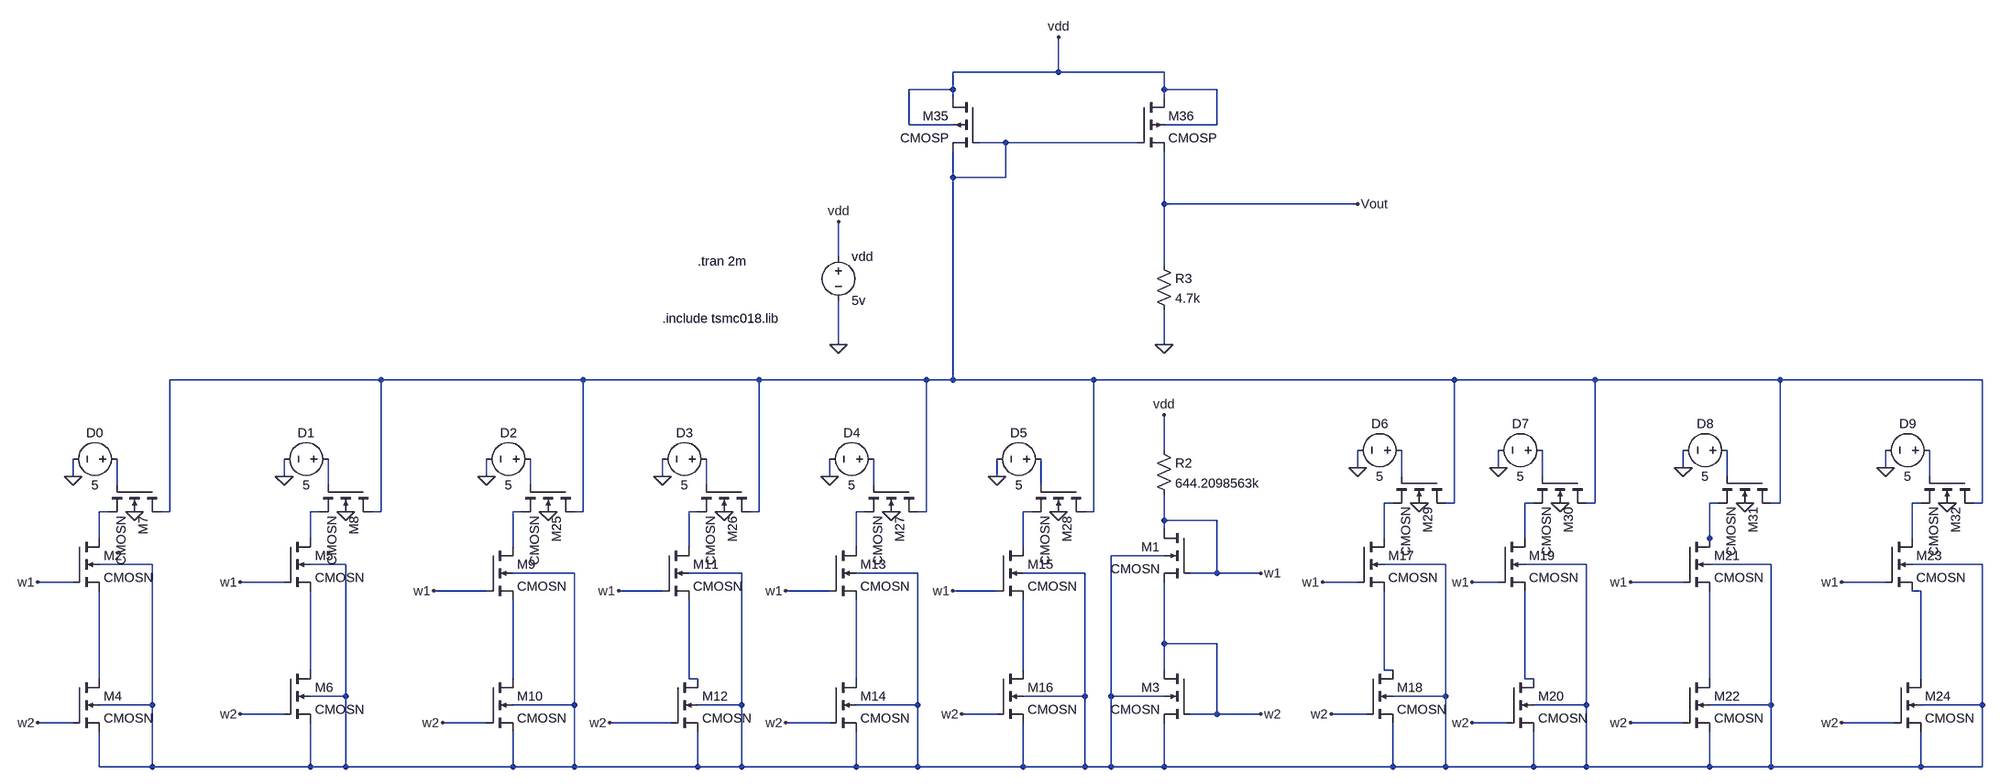
[diagram p0: schematic cd.asc]
cd.asc, the LTspice schematic file:
Version 4
SHEET 1 7472 1236
WIRE 2464 -832 2464 -896
WIRE 2464 -832 2272 -832
WIRE 2656 -832 2464 -832
WIRE 2272 -800 2272 -832
WIRE 2272 -800 2192 -800
WIRE 2656 -800 2656 -832
WIRE 2752 -800 2656 -800
WIRE 2272 -784 2272 -800
WIRE 2656 -784 2656 -800
WIRE 2192 -736 2192 -800
WIRE 2272 -736 2192 -736
WIRE 2752 -736 2752 -800
WIRE 2752 -736 2656 -736
WIRE 2368 -704 2320 -704
WIRE 2608 -704 2368 -704
WIRE 2272 -640 2272 -688
WIRE 2368 -640 2368 -704
WIRE 2368 -640 2272 -640
WIRE 2656 -592 2656 -688
WIRE 3008 -592 2656 -592
WIRE 2064 -496 2064 -560
WIRE 2656 -480 2656 -592
WIRE 2064 -336 2064 -416
WIRE 2656 -336 2656 -400
WIRE 1232 -272 848 -272
WIRE 1600 -272 1232 -272
WIRE 1920 -272 1600 -272
WIRE 2224 -272 1920 -272
WIRE 2272 -272 2272 -640
WIRE 2272 -272 2224 -272
WIRE 2528 -272 2272 -272
WIRE 3184 -272 2528 -272
WIRE 3440 -272 3184 -272
WIRE 3776 -272 3440 -272
WIRE 4144 -272 3776 -272
WIRE 2656 -144 2656 -208
WIRE 3008 -112 3008 -144
WIRE 3264 -112 3264 -144
WIRE 3600 -112 3600 -144
WIRE 3968 -112 3968 -144
WIRE 672 -96 672 -128
WIRE 1056 -96 1056 -128
WIRE 1424 -96 1424 -128
WIRE 1744 -96 1744 -128
WIRE 2048 -96 2048 -128
WIRE 2352 -96 2352 -128
WIRE 3088 -96 3088 -144
WIRE 3344 -96 3344 -144
WIRE 3680 -96 3680 -144
WIRE 4048 -96 4048 -144
WIRE 752 -80 752 -128
WIRE 1136 -80 1136 -128
WIRE 1504 -80 1504 -128
WIRE 1824 -80 1824 -128
WIRE 2128 -80 2128 -128
WIRE 2432 -80 2432 -128
WIRE 3072 -48 3056 -48
WIRE 3184 -48 3184 -272
WIRE 3184 -48 3168 -48
WIRE 3328 -48 3312 -48
WIRE 3440 -48 3440 -272
WIRE 3440 -48 3424 -48
WIRE 3664 -48 3648 -48
WIRE 3776 -48 3776 -272
WIRE 3776 -48 3760 -48
WIRE 4032 -48 4016 -48
WIRE 4144 -48 4144 -272
WIRE 4144 -48 4128 -48
WIRE 736 -32 720 -32
WIRE 848 -32 848 -272
WIRE 848 -32 832 -32
WIRE 1120 -32 1104 -32
WIRE 1232 -32 1232 -272
WIRE 1232 -32 1216 -32
WIRE 1488 -32 1472 -32
WIRE 1600 -32 1600 -272
WIRE 1600 -32 1584 -32
WIRE 1808 -32 1792 -32
WIRE 1920 -32 1920 -272
WIRE 1920 -32 1904 -32
WIRE 2112 -32 2096 -32
WIRE 2224 -32 2224 -272
WIRE 2224 -32 2208 -32
WIRE 2416 -32 2400 -32
WIRE 2528 -32 2528 -272
WIRE 2528 -32 2512 -32
WIRE 2656 -16 2656 -64
WIRE 2752 -16 2656 -16
WIRE 2656 0 2656 -16
WIRE 720 16 720 -32
WIRE 1104 16 1104 -32
WIRE 3056 16 3056 -48
WIRE 3312 16 3312 -48
WIRE 3648 16 3648 -48
WIRE 4016 16 4016 -48
WIRE 1472 32 1472 -32
WIRE 1792 32 1792 -32
WIRE 2096 32 2096 -32
WIRE 2400 32 2400 -32
WIRE 3648 32 3648 16
WIRE 2656 48 2560 48
WIRE 816 64 720 64
WIRE 1168 64 1104 64
WIRE 3168 64 3056 64
WIRE 3424 64 3312 64
WIRE 3760 64 3648 64
WIRE 4144 64 4016 64
WIRE 1584 80 1472 80
WIRE 1888 80 1792 80
WIRE 2208 80 2096 80
WIRE 2512 80 2400 80
WIRE 2752 80 2752 -16
WIRE 2752 80 2704 80
WIRE 2832 80 2752 80
WIRE 672 96 608 96
WIRE 1056 96 976 96
WIRE 3008 96 2944 96
WIRE 3264 96 3216 96
WIRE 3600 96 3504 96
WIRE 3968 96 3888 96
WIRE 1424 112 1328 112
WIRE 1744 112 1664 112
WIRE 2048 112 1968 112
WIRE 2352 112 2272 112
WIRE 4032 112 4016 112
WIRE 2656 208 2656 96
WIRE 2752 208 2656 208
WIRE 1104 256 1104 112
WIRE 2400 256 2400 128
WIRE 2656 256 2656 208
WIRE 3056 256 3056 112
WIRE 3072 256 3056 256
WIRE 720 272 720 112
WIRE 1472 272 1472 128
WIRE 1792 272 1792 128
WIRE 1808 272 1792 272
WIRE 2096 272 2096 128
WIRE 3312 272 3312 112
WIRE 3328 272 3312 272
WIRE 3648 272 3648 112
WIRE 4032 272 4032 112
WIRE 1168 304 1168 64
WIRE 1168 304 1104 304
WIRE 2512 304 2512 80
WIRE 2512 304 2400 304
WIRE 2560 304 2560 48
WIRE 2656 304 2560 304
WIRE 3168 304 3168 64
WIRE 3168 304 3072 304
WIRE 816 320 816 64
WIRE 816 320 720 320
WIRE 1584 320 1584 80
WIRE 1584 320 1472 320
WIRE 1888 320 1888 80
WIRE 1888 320 1808 320
WIRE 2208 320 2208 80
WIRE 2208 320 2096 320
WIRE 3424 320 3424 64
WIRE 3424 320 3328 320
WIRE 3760 320 3760 64
WIRE 3760 320 3648 320
WIRE 4144 320 4144 64
WIRE 4144 320 4032 320
WIRE 1056 336 976 336
WIRE 2352 336 2288 336
WIRE 2752 336 2752 208
WIRE 2752 336 2704 336
WIRE 2832 336 2752 336
WIRE 3024 336 2960 336
WIRE 672 352 608 352
WIRE 1424 352 1344 352
WIRE 1760 352 1648 352
WIRE 2048 352 1968 352
WIRE 3280 352 3216 352
WIRE 3600 352 3504 352
WIRE 3984 352 3888 352
WIRE 720 432 720 368
WIRE 816 432 816 320
WIRE 816 432 720 432
WIRE 1104 432 1104 352
WIRE 1104 432 816 432
WIRE 1168 432 1168 304
WIRE 1168 432 1104 432
WIRE 1472 432 1472 368
WIRE 1472 432 1168 432
WIRE 1584 432 1584 320
WIRE 1584 432 1472 432
WIRE 1808 432 1808 368
WIRE 1808 432 1584 432
WIRE 1888 432 1888 320
WIRE 1888 432 1808 432
WIRE 2096 432 2096 368
WIRE 2096 432 1888 432
WIRE 2208 432 2208 320
WIRE 2208 432 2096 432
WIRE 2400 432 2400 352
WIRE 2400 432 2208 432
WIRE 2512 432 2512 304
WIRE 2512 432 2400 432
WIRE 2560 432 2560 304
WIRE 2560 432 2512 432
WIRE 2656 432 2656 352
WIRE 2656 432 2560 432
WIRE 3072 432 3072 352
WIRE 3072 432 2656 432
WIRE 3168 432 3168 304
WIRE 3168 432 3072 432
WIRE 3328 432 3328 368
WIRE 3328 432 3168 432
WIRE 3424 432 3424 320
WIRE 3424 432 3328 432
WIRE 3648 432 3648 368
WIRE 3648 432 3424 432
WIRE 3760 432 3760 320
WIRE 3760 432 3648 432
WIRE 4032 432 4032 368
WIRE 4032 432 3760 432
WIRE 4144 432 4144 320
WIRE 4144 432 4032 432
FLAG 2064 -336 0
FLAG 2832 80 w1
FLAG 2832 336 w2
FLAG 976 336 w2
FLAG 976 96 w1
FLAG 1328 112 w1
FLAG 1664 112 w1
FLAG 1968 112 w1
FLAG 2272 112 w1
FLAG 2944 96 w1
FLAG 3216 96 w1
FLAG 3504 96 w1
FLAG 3888 96 w1
FLAG 1344 352 w2
FLAG 1648 352 w2
FLAG 2288 336 w2
FLAG 2960 336 w2
FLAG 3216 352 w2
FLAG 3504 352 w2
FLAG 3888 352 w2
FLAG 1968 352 w2
FLAG 672 -96 0
FLAG 608 96 w1
FLAG 608 352 w2
FLAG 2064 -560 vdd
FLAG 2464 -896 vdd
FLAG 2656 -336 0
FLAG 784 -32 0
FLAG 2656 -208 vdd
FLAG 1056 -96 0
FLAG 1168 -32 0
FLAG 1424 -96 0
FLAG 1536 -32 0
FLAG 1744 -96 0
FLAG 1856 -32 0
FLAG 2048 -96 0
FLAG 2160 -32 0
FLAG 2352 -96 0
FLAG 2464 -32 0
FLAG 3008 -112 0
FLAG 3120 -48 0
FLAG 3264 -112 0
FLAG 3376 -48 0
FLAG 3600 -112 0
FLAG 3712 -48 0
FLAG 3968 -112 0
FLAG 4080 -48 0
FLAG 3008 -592 Vout
SYMBOL cmosn 2704 0 M0
SYMATTR InstName M1
SYMATTR Value2 l=5u w=640u
SYMBOL cmosn 672 16 R0
SYMATTR InstName M2
SYMATTR Value2 l=5u w=10u
SYMBOL cmosn 2704 256 M0
SYMATTR InstName M3
SYMATTR Value2 l=5u w=640u
SYMBOL cmosn 672 272 R0
SYMATTR InstName M4
SYMATTR Value2 l=5u w=10u
SYMBOL voltage 2064 -512 R0
WINDOW 123 0 0 Left 0
WINDOW 39 0 0 Left 0
SYMATTR InstName vdd
SYMATTR Value 5v
SYMBOL cmosn 1056 16 R0
SYMATTR InstName M5
SYMATTR Value2 l=5u w=20u
SYMBOL cmosn 1056 256 R0
SYMATTR InstName M6
SYMATTR Value2 l=5u w=20u
SYMBOL cmosn 1424 32 R0
SYMATTR InstName M9
SYMATTR Value2 l=5u w=40u
SYMBOL cmosn 1424 272 R0
SYMATTR InstName M10
SYMATTR Value2 l=5u w=40u
SYMBOL cmosn 1744 32 R0
SYMATTR InstName M11
SYMATTR Value2 l=5u w=80u
SYMBOL cmosn 1760 272 R0
SYMATTR InstName M12
SYMATTR Value2 l=5u w=80u
SYMBOL cmosn 2048 32 R0
SYMATTR InstName M13
SYMATTR Value2 l=5u w=160u
SYMBOL cmosn 2048 272 R0
SYMATTR InstName M14
SYMATTR Value2 l=5u w=160u
SYMBOL cmosn 2352 32 R0
SYMATTR InstName M15
SYMATTR Value2 l=5u w=320u
SYMBOL cmosn 2352 256 R0
SYMATTR InstName M16
SYMATTR Value2 l=5u w=320u
SYMBOL cmosn 3008 16 R0
SYMATTR InstName M17
SYMATTR Value2 l=5u w=640u
SYMBOL cmosn 3024 256 R0
SYMATTR InstName M18
SYMATTR Value2 l=5u w=640u
SYMBOL cmosn 3264 16 R0
SYMATTR InstName M19
SYMATTR Value2 l=5u w=1280u
SYMBOL cmosn 3280 272 R0
SYMATTR InstName M20
SYMATTR Value2 l=5u w=1280u
SYMBOL cmosn 3600 16 R0
SYMATTR InstName M21
SYMATTR Value2 l=5u w=2560u
SYMBOL cmosn 3600 272 R0
SYMATTR InstName M22
SYMATTR Value2 l=5u w=2560u
SYMBOL cmosn 3968 16 R0
SYMATTR InstName M23
SYMATTR Value2 l=5u w=5120u
SYMBOL cmosn 3984 272 R0
SYMATTR InstName M24
SYMATTR Value2 l=5u w=5120u
SYMBOL res 2640 -160 R0
SYMATTR InstName R2
SYMATTR Value 644.2098563k
SYMBOL cmosn 832 -80 R90
SYMATTR InstName M7
SYMATTR Value2 l=5u w=10u
SYMBOL voltage 768 -128 R90
WINDOW 0 -32 56 VBottom 2
WINDOW 3 32 56 VTop 2
WINDOW 123 0 0 Left 0
WINDOW 39 0 0 Left 0
SYMATTR InstName D0
SYMATTR Value 5
SYMBOL cmosp 2320 -784 M0
SYMATTR InstName M35
SYMATTR Value2 l=5u w=100u
SYMBOL cmosp 2608 -784 R0
SYMATTR InstName M36
SYMATTR Value2 l=5u w=1000u
SYMBOL res 2640 -496 R0
SYMATTR InstName R3
SYMATTR Value 4.7k
SYMBOL cmosn 1216 -80 R90
SYMATTR InstName M8
SYMATTR Value2 l=5u w=10u
SYMBOL voltage 1152 -128 R90
WINDOW 0 -32 56 VBottom 2
WINDOW 3 32 56 VTop 2
WINDOW 123 0 0 Left 0
WINDOW 39 0 0 Left 0
SYMATTR InstName D1
SYMATTR Value 5
SYMBOL cmosn 1584 -80 R90
SYMATTR InstName M25
SYMATTR Value2 l=5u w=10u
SYMBOL voltage 1520 -128 R90
WINDOW 0 -32 56 VBottom 2
WINDOW 3 32 56 VTop 2
WINDOW 123 0 0 Left 0
WINDOW 39 0 0 Left 0
SYMATTR InstName D2
SYMATTR Value 5
SYMBOL cmosn 1904 -80 R90
SYMATTR InstName M26
SYMATTR Value2 l=5u w=10u
SYMBOL voltage 1840 -128 R90
WINDOW 0 -32 56 VBottom 2
WINDOW 3 32 56 VTop 2
WINDOW 123 0 0 Left 0
WINDOW 39 0 0 Left 0
SYMATTR InstName D3
SYMATTR Value 5
SYMBOL cmosn 2208 -80 R90
SYMATTR InstName M27
SYMATTR Value2 l=5u w=10u
SYMBOL voltage 2144 -128 R90
WINDOW 0 -32 56 VBottom 2
WINDOW 3 32 56 VTop 2
WINDOW 123 0 0 Left 0
WINDOW 39 0 0 Left 0
SYMATTR InstName D4
SYMATTR Value 5
SYMBOL cmosn 2512 -80 R90
SYMATTR InstName M28
SYMATTR Value2 l=5u w=10u
SYMBOL voltage 2448 -128 R90
WINDOW 0 -32 56 VBottom 2
WINDOW 3 32 56 VTop 2
WINDOW 123 0 0 Left 0
WINDOW 39 0 0 Left 0
SYMATTR InstName D5
SYMATTR Value 5
SYMBOL cmosn 3168 -96 R90
SYMATTR InstName M29
SYMATTR Value2 l=5u w=10u
SYMBOL voltage 3104 -144 R90
WINDOW 0 -32 56 VBottom 2
WINDOW 3 32 56 VTop 2
WINDOW 123 0 0 Left 0
WINDOW 39 0 0 Left 0
SYMATTR InstName D6
SYMATTR Value 5
SYMBOL cmosn 3424 -96 R90
SYMATTR InstName M30
SYMATTR Value2 l=5u w=10u
SYMBOL voltage 3360 -144 R90
WINDOW 0 -32 56 VBottom 2
WINDOW 3 32 56 VTop 2
WINDOW 123 0 0 Left 0
WINDOW 39 0 0 Left 0
SYMATTR InstName D7
SYMATTR Value 5
SYMBOL cmosn 3760 -96 R90
SYMATTR InstName M31
SYMATTR Value2 l=5u w=10u
SYMBOL voltage 3696 -144 R90
WINDOW 0 -32 56 VBottom 2
WINDOW 3 32 56 VTop 2
WINDOW 123 0 0 Left 0
WINDOW 39 0 0 Left 0
SYMATTR InstName D8
SYMATTR Value 5
SYMBOL cmosn 4128 -96 R90
SYMATTR InstName M32
SYMATTR Value2 l=5u w=10u
SYMBOL voltage 4064 -144 R90
WINDOW 0 -32 56 VBottom 2
WINDOW 3 32 56 VTop 2
WINDOW 123 0 0 Left 0
WINDOW 39 0 0 Left 0
SYMATTR InstName D9
SYMATTR Value 5
TEXT 1744 -384 Left 2 !.include tsmc018.lib
TEXT 1808 -488 Left 2 !.tran 2m

The netlist it stands for:
* cd.asc
M1 w1 w1 w2 N022 CMOSN l=5u w=640u
M2 N016 w1 N027 N022 CMOSN l=5u w=10u
M3 w2 w2 N022 N022 CMOSN l=5u w=640u
M4 N027 w2 N022 N022 CMOSN l=5u w=10u
vdd vdd 0 5v
M5 N017 w1 N024 N022 CMOSN l=5u w=20u
M6 N024 w2 N022 N022 CMOSN l=5u w=20u
M9 N018 w1 N028 N022 CMOSN l=5u w=40u
M10 N028 w2 N022 N022 CMOSN l=5u w=40u
M11 N019 w1 N029 N022 CMOSN l=5u w=80u
M12 N029 w2 N022 N022 CMOSN l=5u w=80u
M13 N020 w1 N030 N022 CMOSN l=5u w=160u
M14 N030 w2 N022 N022 CMOSN l=5u w=160u
M15 N021 w1 N025 N022 CMOSN l=5u w=320u
M16 N025 w2 N022 N022 CMOSN l=5u w=320u
M17 N012 w1 N026 N022 CMOSN l=5u w=640u
M18 N026 w2 N022 N022 CMOSN l=5u w=640u
M19 N013 w1 N031 N022 CMOSN l=5u w=1280u
M20 N031 w2 N022 N022 CMOSN l=5u w=1280u
M21 N014 w1 N032 N022 CMOSN l=5u w=2560u
M22 N032 w2 N022 N022 CMOSN l=5u w=2560u
M23 N015 w1 N023 N022 CMOSN l=5u w=5120u
M24 N023 w2 N022 N022 CMOSN l=5u w=5120u
R2 vdd w1 644.2098563k
M7 N001 N006 N016 0 CMOSN l=5u w=10u
V§D0 N006 0 5
M35 vdd N001 N001 vdd CMOSP l=5u w=100u
M36 vdd N001 Vout vdd CMOSP l=5u w=1000u
R3 Vout 0 4.7k
M8 N001 N007 N017 0 CMOSN l=5u w=10u
V§D1 N007 0 5
M25 N001 N008 N018 0 CMOSN l=5u w=10u
V§D2 N008 0 5
M26 N001 N009 N019 0 CMOSN l=5u w=10u
V§D3 N009 0 5
M27 N001 N010 N020 0 CMOSN l=5u w=10u
V§D4 N010 0 5
M28 N001 N011 N021 0 CMOSN l=5u w=10u
V§D5 N011 0 5
M29 N001 N002 N012 0 CMOSN l=5u w=10u
V§D6 N002 0 5
M30 N001 N003 N013 0 CMOSN l=5u w=10u
V§D7 N003 0 5
M31 N001 N004 N014 0 CMOSN l=5u w=10u
V§D8 N004 0 5
M32 N001 N005 N015 0 CMOSN l=5u w=10u
V§D9 N005 0 5
.model NMOS NMOS
.model PMOS PMOS
.lib standard.mos
.include tsmc018.lib
.tran 2m
.backanno
.end